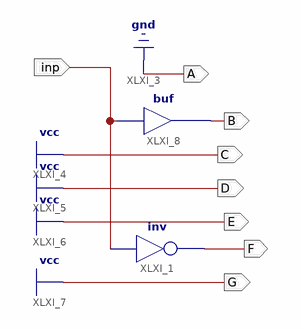
[diagram p0: schematic sheet 1]
// Xilinx ISE schematic db.sch (spartan6) as structural Verilog: 2 symbols, 8 ports
module db (
  input  inp,
  output A,
  output F,
  output C,
  output D,
  output E,
  output G,
  output B
);

  not XLXI_1 (F, inp);
  buf XLXI_8 (B, inp);

  assign A = 1'b0;
  assign C = 1'b1;
  assign D = 1'b1;
  assign E = 1'b1;
  assign G = 1'b1;
endmodule
